# EAGLE design projeto-nrf-gps-blue (EAGLE 5.12)
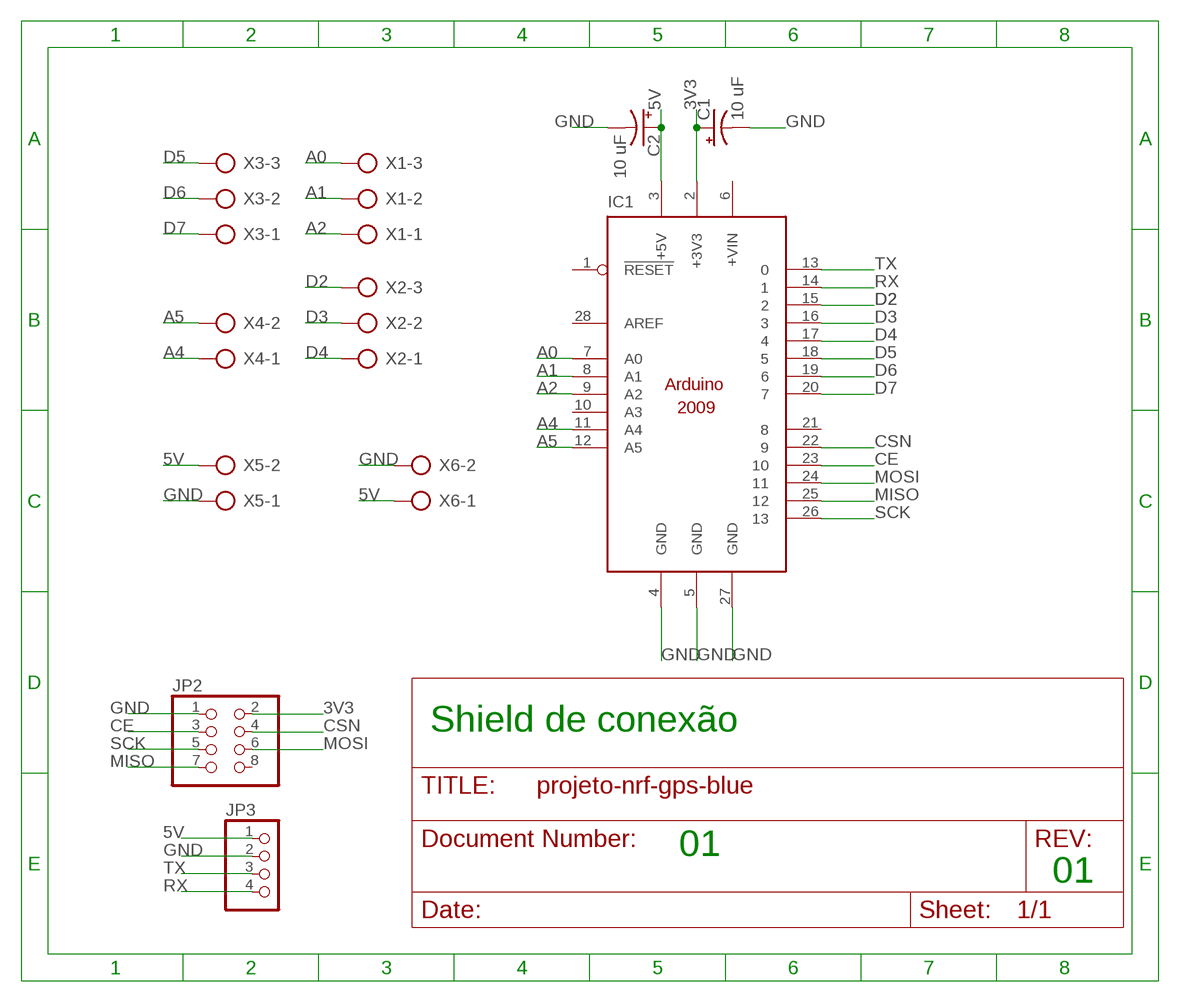
[diagram p0: schematic, sheet 1]

## Parts
C1  10 uF  CAP_POLPTH2  [CPOL-RADIAL-10UF-25V]
C2  10 uF  CAP_POLPTH2  [CPOL-RADIAL-10UF-25V]
IC1  ARDUINO2009_12  [ARDUINO2009_2]
JP2  PINHD-2X4  [2X04]
JP3  PINHD-1X4  [1X04]
X1  AK500/3-H  [AK500/3-H]
X2  AK500/3-H  [AK500/3-H]
X3  AK500/3-H  [AK500/3-H]
X4  AK500/2-H  [AK500/2-H]
X5  AK500/2-H  [AK500/2-H]
X6  AK500/2-H  [AK500/2-H]

## Nets
3V3: C1.1(+) IC1.2(+3V3) JP2.2
5V: C2.1(+) IC1.3(+5V) JP3.1 X5.2 X6.1
A0: IC1.7(A0) X1.3
A1: IC1.8(A1) X1.2
A2: IC1.9(A2) X1.1
A4: IC1.11(A4) X4.1
A5: IC1.12(A5) X4.2
CE: IC1.23 JP2.3
CSN: IC1.22 JP2.4
D2: IC1.15 X2.3
D3: IC1.16 X2.2
D4: IC1.17 X2.1
D5: IC1.18 X3.3
D6: IC1.19 X3.2
D7: IC1.20 X3.1
GND: C1.2(-) C2.2(-) IC1.4(GND) IC1.5(GND) IC1.27(GND) JP2.1 JP3.2 X5.1 X6.2
MISO: IC1.25 JP2.7
MOSI: IC1.24 JP2.6
RX: IC1.14 JP3.4
SCK: IC1.26 JP2.5
TX: IC1.13 JP3.3
Unconnected: IC1.1(!RESET) IC1.6(+VIN) IC1.10(A3) IC1.21 IC1.28(AREF) JP2.8

## Notes on the sheet
- Shield de conexão
- 01
- 01

## Library data of the parts
C1 C2 = SparkFun:CAP_POL: Capacitor Polarized These are standard SMD and PTH capacitors. Normally 10uF, 47uF, and 100uF in electrolytic and tantalum varieties. Always verify the external diameter of the through hole cap, it varies with capacity, voltage, and manufacturer. The EIA devices should be standard.
IC1 = arduino:ARDUINO2009_1: The Arduino Duemilanove ("2009") is a microcontroller board based on the ATmega168 or ATmega328. - 14 digital input/output pins (of which 6 can be used as PWM outputs) - 6 analog inputs, a 16 MHz crystal oscillator - USB connection - power jack - ISP header - reset button It contains everything needed to support the microcontroller; simply connect it to a computer with a USB cable or power it with a AC-to-DC adapter or battery to get started http://arduino.cc/en/Main/ArduinoBoardDuemilanove
JP2 = pinhead:PINHD-2X4: PIN HEADER
JP3 = pinhead:PINHD-1X4: PIN HEADER
X1-X3 = con-ptr500:AK500/3-H: CONNECTOR Aug. 2004 / PTR Meßtechnik: Die Bezeichnung der Serie AK505 wurde geändert. Es handelt sich hierbei um AK500 in horizontaler Ausführung.; OC_FARNELL: unknown; OC_NEWARK: unknown
X4-X6 = con-ptr500:AK500/2-H: CONNECTOR Aug. 2004 / PTR Meßtechnik: Die Bezeichnung der Serie AK505 wurde geändert. Es handelt sich hierbei um AK500 in horizontaler Ausführung.; OC_FARNELL: unknown; OC_NEWARK: unknown

## Board
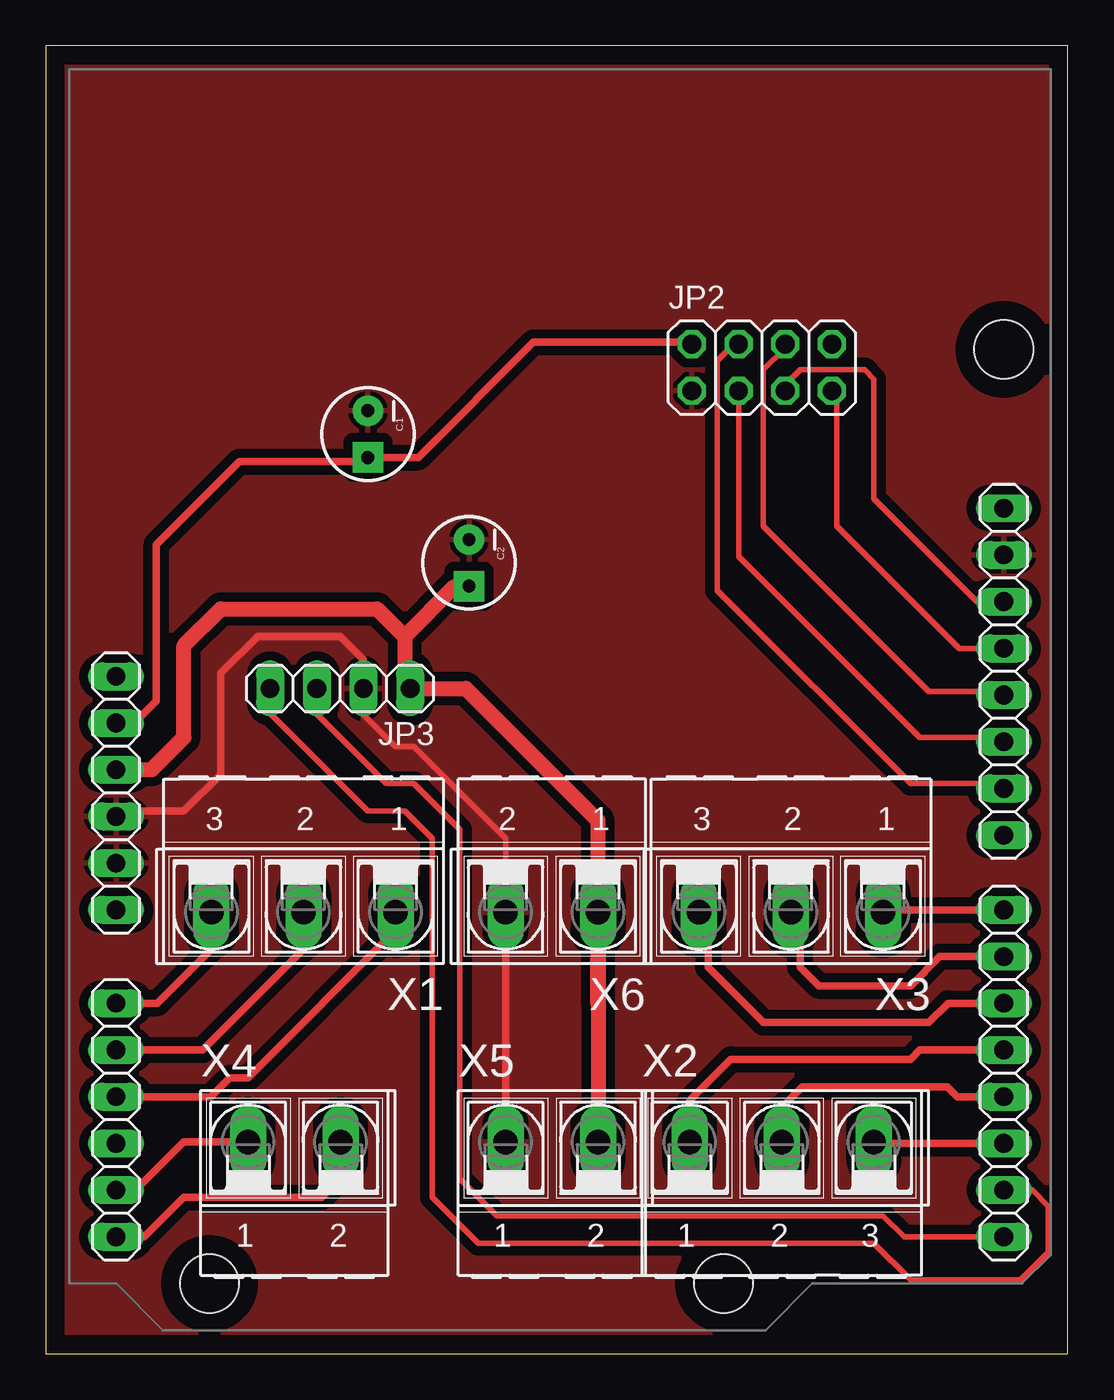
[diagram p1: board, top side]

Size 55.55 x 71.11 mm. Coordinates in mm from the lower left corner, seen from the top.
Outline: 0,0 55.55,0 55.55,71.11 0,71.11 0,0
Copper layers (1*16): Top 0.035mm / dielectric 1.5mm / Bottom 0.035mm
Design rules "default *": minimum track width 10mil, minimum drill 24mil, track to track 20mil, track to pad 20mil, pad to pad 20mil, via to via 20mil, smd to smd 8mil, copper to edge 40mil, drill to drill 8mil, minimum pad ring 10mil, minimum via ring 8mil, stop-mask expansion 4mil, vias tented up to drill 0mil, thermal gap 10mil

### Footprints (pad centres in the part's own frame; a part is rotated, then mirrored left to right if it is on the bottom)
CPOL-RADIAL-10UF-25V = drill 0.7 pad 1.651 square: 1 1.27,0 | drill 0.7 pad 1.651 round: 2 -1.27,0
ARDUINO2009_2 = drill 1.016 long: 1 33.02,2.54; 2 35.56,2.54; 3 38.1,2.54; 4 40.64,2.54; 5 43.18,2.54; 6 45.72,2.54; 7 50.8,2.54; 8 53.34,2.54; 9 55.88,2.54; 10 58.42,2.54; 11 60.96,2.54; 12 63.5,2.54; 13 63.5,50.8; 14 60.96,50.8; 15 58.42,50.8; 16 55.88,50.8; 17 53.34,50.8; 18 50.8,50.8; 19 48.26,50.8; 20 45.72,50.8; 21 41.656,50.8; 22 39.116,50.8; 23 36.576,50.8; 24 34.036,50.8; 25 31.496,50.8; 26 28.956,50.8; 27 26.416,50.8; 28 23.876,50.8 | hole 3.2: 15.24,50.8; 66.04,35.56; 66.04,7.62
2X04 = drill 1.016 octagon: 1 -3.81,-1.27; 2 -3.81,1.27; 3 -1.27,-1.27; 4 -1.27,1.27; 5 1.27,-1.27; 6 1.27,1.27; 7 3.81,-1.27; 8 3.81,1.27
1X04 = drill 1.016 long: 1 -3.81,0; 2 -1.27,0; 3 1.27,0; 4 3.81,0
AK500/3-H = drill 1.321 long: 1 -5.004,0; 2 0,0; 3 5.004,0
AK500/2-H = drill 1.321 long: 1 -2.515,0; 2 2.515,0

### Placement (x,y rotation side)
C1  17.5,50 270 top
C2  23,43 270 top
IC1  1.27,69.85 270 top
JP2  38.92,53.63 0 top
JP3  15.99,36.17 180 top
X1  14,24 180 top
X2  40,11.5 0 top
X3  40.5,24 180 top
X4  13.5,11.5 0 top
X5  27.5,11.5 0 top
X6  27.5,24 180 top

### Tracks (layer width: path | path; a pad name or v marks a point on that pad's centre or on a via)
3V3
  Top 0.406: JP2.2 35.01,55 26.5,55 20.23,48.73 C1.1 17.27,48.5 10.5,48.5 6,44 6,35.5 4.79,34.29 IC1.2
5V
  Top 0.813: X5.2 X6.1 30,19.02 30,29 22.83,36.17 JP3.1 19.5,36.47 19.5,39 | IC1.3 5.75,31.75 7.5,33.5 7.5,38.5 9.5,40.5 18,40.5 19.5,39 | C2.1 22.23,41.73 19.5,39
A0
  Top 0.406: IC1.7 6.05,19.05 9,22 X1.3
A1
  Top 0.406: IC1.8 8.51,16.51 14,22 X1.2
A2
  Top 0.406: IC1.9 8.97,13.97 10,15 11,15 19,23 X1.1
A4
  Top 0.406: IC1.11 4.89,8.89 7.5,11.5 X4.1
A5
  Top 0.406: X4.2 16,11.48 16,9.5 15,8.5 7.5,8.5 5.35,6.35 IC1.12
CE
  Top 0.305: JP2.3 37.65,43.35 47.5,33.5 51.84,33.5 IC1.23
CSN
  Top 0.305: JP2.4 37.4,54.9 36.5,54 36.5,41.5 47,31 51.8,31 IC1.22
D2
  Top 0.406: IC1.15 45.07,11.43 X2.3
D3
  Top 0.406: IC1.16 49.53,13.97 49,14.5 41.12,14.5 40,13.38 X2.2 | X2.2
D4
  Top 0.406: IC1.17 47.51,16.51 47,16 37.24,16 35,13.76 X2.1
D5
  Top 0.406: IC1.18 49.05,19.05 48,18 39,18 36,21 36,23.5 X3.3
D6
  Top 0.406: IC1.19 48.59,21.59 47,20 42,20 41,21 41,23.5 X3.2
D7
  Top 0.406: IC1.20 45.63,24.13 X3.1
GND
  Top 0.305: JP3.2 17,35.91 17,35 19,33 20,33 24.98,28.02 X6.2
  Top 0.406: X6.2 X5.1 | JP3.2 17.26,37.74 16,39 11.5,39 9.5,37 9.5,31.5 7.5,29.5 4.1,29.5 IC1.4
  pour Top: 0,0 0,71 55.5,71 55.5,68.5 55.5,0
MISO
  Top 0.305: IC1.25 49.65,38.35 43,45 43,52.09 JP2.7
MOSI
  Top 0.305: JP2.6 40.19,54.69 39,53.5 39,45 48,36 51.88,36 IC1.24
RX
  Top 0.305: IC1.14 53.61,8.89 54.5,8 54.5,5.5 53,4 47,4 45,6 23.5,6 21,8.5 21,28 19.5,29.5 17.5,29.5 12,35 12,35.99 JP3.4
SCK
  Top 0.305: IC1.26 50.61,40.89 45,46.5 45,53 44.5,53.5 41,53.5 40.5,53 40.5,52.67 JP2.5
TX
  Top 0.305: IC1.13 46.65,6.35 45.5,7.5 24.5,7.5 22.5,9.5 22.5,28.5 20,31 18.5,31 14.5,35 14.5,35.95 JP3.3